# Altium schematic sheet VoltageRegulators.SchDoc
size A4
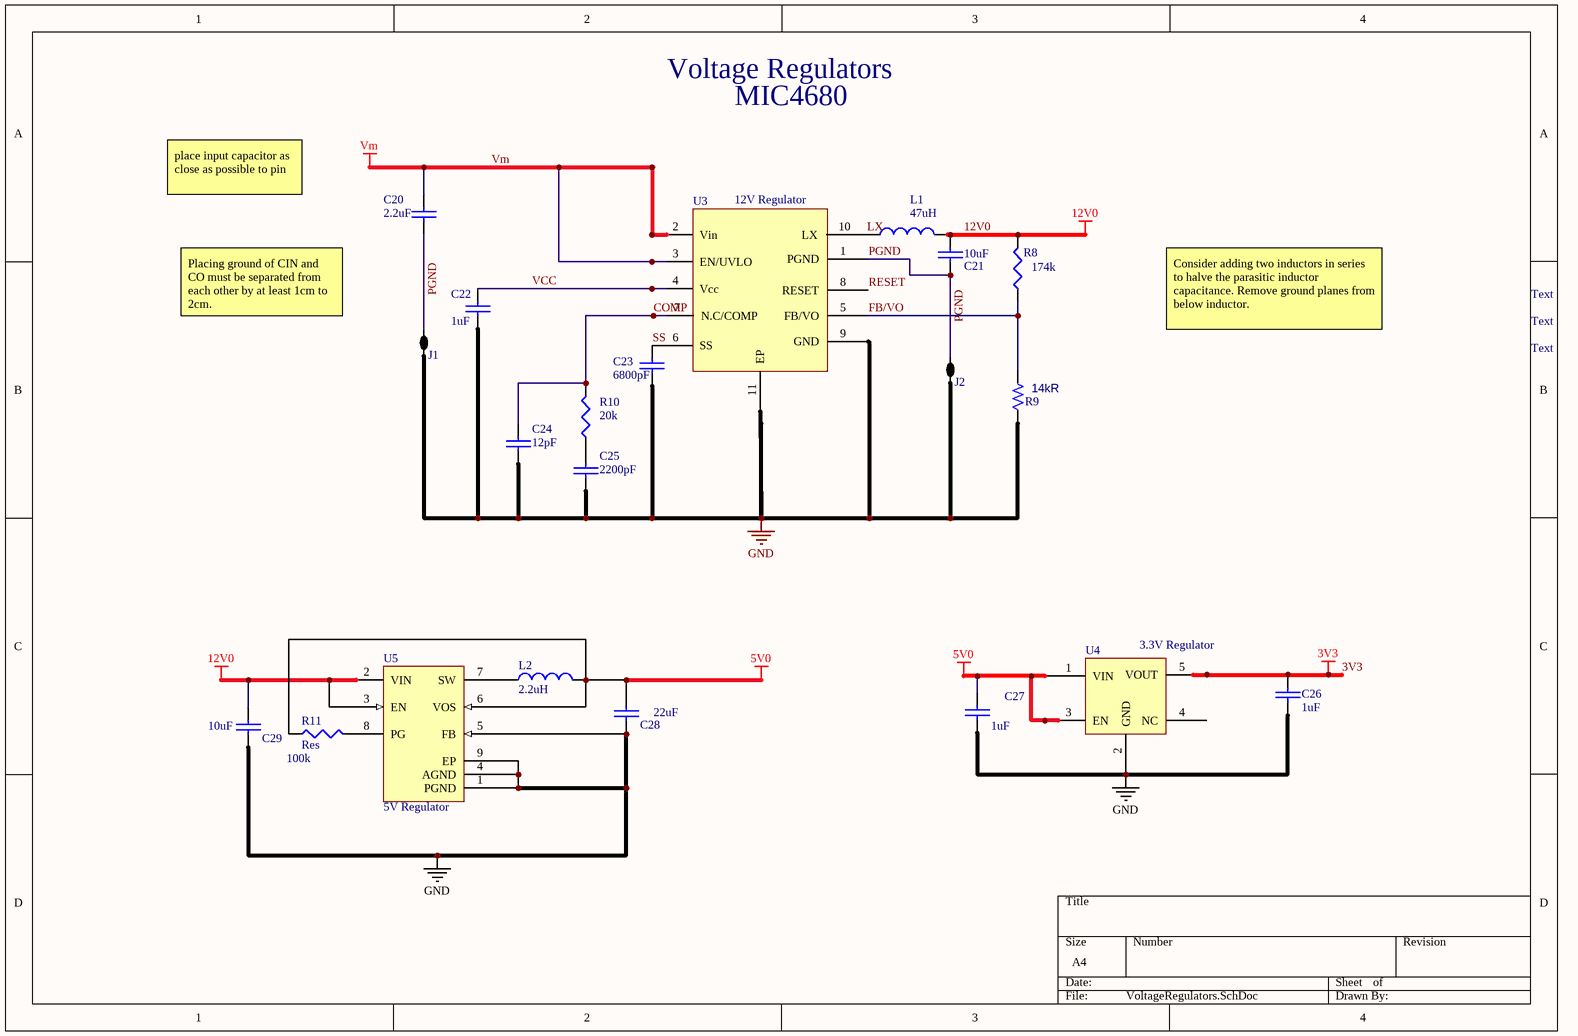
[diagram p0: VoltageRegulators.SchDoc]

## Parts
C20  value 2.2uF  [CAP0805]  (hidden comment: Capacitor)
C21  value 10uF  [CAP1210]  (hidden comment: Capacitor)
C22  value 1uF  [CAP0402]  (hidden comment: Capacitor)
C23  value 6800pF  [CAP0402]  (hidden comment: Capacitor)
C24  value 12pF  [CAP0402]  (hidden comment: Capacitor)
C25  value 2200pF  [CAP0402]  (hidden comment: Capacitor)
C26  value 1uF  [CAP0402]  (hidden comment: Capacitor)
C27  value 1uF  [CAP0402]  (hidden comment: Capacitor)
C28  value 22uF  [CAP0805]  (hidden comment: Capacitor)
C29  value 10uF  [CAP0805]  (hidden comment: Capacitor)
J1  2 way net tie junction  [2way_LP]  (value not drawn)  (net tie, no BOM)
J2  2 way net tie junction  [2way_LP]  (value not drawn)  (net tie, no BOM)
L1  value 47uH  [74404064470]  (hidden comment: Inductor)
L2  value 2.2uH  [VLS3012HBX]  (hidden comment: Inductor)
R8  value 174k  [RES0402]  (hidden comment: Res)
R9  Resistance: 14kR  [RES0402]  (hidden comment: Resistor)
R10  value 20k  [RES0402]  (hidden comment: Res)
R11  Res  value 100k  [RES0402]
U3  12V Regulator  [L10 3x2 0.5mm Pitch]
U4  3.3V Regulator  [SOT23-5]
U5  5V Regulator  [DSG8-1600X900TP]

## Nets
3V3: C26.1 U4.5(VOUT)
5V0: C27.1 C28.1 L2.2 R11.1 U4.1(VIN) U4.3(EN) U5.6(VOS)
12V0: C21.1 C29.1 L1.2 R8.2 U5.2(VIN) U5.3(EN)
GND: C22.2 C23.2 C24.2 C25.2 C26.2 C27.2 C28.2 C29.2 J1.1 J2.1 R9.1 U3.9(GND) U3.11(EP) U4.2(GND) U5.1(PGND) U5.4(AGND) U5.5(FB) U5.9(EP)
Vm: C20.1 U3.2(Vin) U3.3(EN/UVLO)
COMP: C24.1 R10.2 U3.7(N.C/COMP)
FB/VO: R8.1 R9.2 U3.5(FB/VO)
LX: L1.1 U3.10(LX)
PGND: C20.2 C21.2 J1.2 J2.2 U3.1(PGND)
RESET: U3.8(RESET)
SS: C23.1 U3.6(SS)
VCC: C22.1 U3.4(Vcc)
NetC25_1: C25.1 R10.1
NetL2_1: L2.1 U5.7(SW)
NetR11_2: R11.2 U5.8(PG)

Not connected (* = marked no-connect by the designer): U4 4(NC)

## Notes on the sheet
- Voltage Regulators
- MIC4680
- place input capacitor as close as possible to pin
- Placing ground of CIN and CO must be separated from each other by at least 1cm to 2cm.
- Text
- Consider adding two inductors in series to halve the parasitic inductor capacitance. Remove ground planes from below inductor.

## Library data of the parts
C20 = Capacitor: Manufacturer: TDK Corporation; Manufacturer Part Number: C2012X7R1V225K085AC; Tolerance: 10%; Voltage: 35V; Temperature Coefficient: X7R; Supplier: Digikey; Supplier Part Number: 445-14547-1-ND; Footprint: 0805; Component Type: Capacitor Ceramic
C21 = Capacitor: Manufacturer: KEMET; Manufacturer Part Number: C1210C106K9RAC7800; Tolerance: 10%; Voltage: 6.3V; Temperature Coefficient: X7R; Supplier: Digikey; Supplier Part Number: 399-13220-1-ND; Footprint: 1210; Component Type: Capacitor Ceramic; Price: 1.39
C22 C26 C27 = Capacitor: Manufacturer: TDK Corporation; Manufacturer Part Number: C1005X5R1V105K050BC; Tolerance: 10%; Voltage: 35V; Temperature Coefficient: X5R; Supplier: Digikey; Component Type: Capacitor Ceramic
  C22: Supplier Part Number: 445-9073-1-ND; Footprint: 0201
  C26 C27: Supplier Part Number: 1276-6795-1-ND; Footprint: 0201 (0603 Metric)
C23 = Capacitor: Manufacturer: KEMET; Manufacturer Part Number: C0402C682J5RACTU; Tolerance: 10%; Voltage: 50V; Temperature Coefficient: X7R; Supplier: Digi-Key; Supplier Part Number: 399-8975-1-ND; Footprint: 0402; Component Type: Capacitor Ceramic; Price: 0.13
C24 = Capacitor: Manufacturer: KEMET; Manufacturer Part Number: C0402C120J3GACAUTO; Tolerance: 5%; Voltage: 25; Supplier: digikey; Supplier Part Number: 399-6829-1-ND; Footprint: 0402; Component Type: Capacitor Ceramic; Price: 0.41; Temperature Coefficient: *
C25 = Capacitor: Manufacturer: Murata Electronics North America; Manufacturer Part Number: GRM155R71H222KA01D; Tolerance: 10%; Voltage: 50V; Temperature Coefficient: X7R; Supplier: Digi-Key; Supplier Part Number: 490-1305-1-ND; Footprint: 0402; Component Type: Capacitor Ceramic; Price: 0.14
C28 = Capacitor: Manufacturer: TDK Corporation; Manufacturer Part Number: C2012X5R0J226K125AB; Tolerance: 10%; Voltage: 6.3V; Temperature Coefficient: X5R; Supplier: Digikey; Supplier Part Number: 445-7679-1-ND; Footprint: 0805; Component Type: Ceramic Capacitor; Price: .99
C29 = Capacitor: Manufacturer: Murata Electronics North America; Manufacturer Part Number: GRM21BR61E106MA73L; Tolerance: 10%; Voltage: 25V; Temperature Coefficient: X5R; Supplier: Digikey; Supplier Part Number: 490-10748-1-ND; Footprint: 0805; Component Type: Ceramic Capacitor; Price: .29
J1 J2 = 2way: ComponentLink1URL: http://www.edatools.cz/addons; ComponentLink1Description: Source; FootprintNote: LP=12mil, MP=40mil, HP=120mil
L1 = Inductor: FIXED IND 47UH 1.2A 200 MOHM SMD; Manufacturer: Wurth Electronics Inc.; Component Type: Inductor; Manufacturer Part Number: 74404064470; Price: 1.63; Supplier: Digi-Key; Supplier Part Number: 732-5556-1-ND; ESR: *; Saturation Current: *
L2 = Inductor: FIXED IND 2.2UH 3.15A 106 MOHM; Manufacturer: TDK Corporation; Manufacturer Part Number: VLS3012HBX-2R2M; Component Type: Inductor; Price: 1.49; Supplier: Digikey; Supplier Part Number: 445-175069-1-ND
R8 = Resistor: Manufacturer: Yageo; Manufacturer Part Number: RC0402FR-07174KL; Power Rating: 0.063W; Tolerance: 1%; Component Type: Resistor; Price: .14; Supplier: Digikey; Supplier Part Number: YAG3008CT-ND; Footprint: 0402
R9 = Resistor: RES SMD 14K OHM 1% 1/16W 0402; Manufacturer 1: Yageo; Manufacturer Part Number 1: RC0402FR-0714KL; Power Rating: 62.5mW; Voltage Rating: 50V; Max Power Dissipation: 63mW; Temperature Coefficient: 100ppm/°C; Supplier 1: Digi-Key; Supplier Part Number 1: 311-14.0KLRCT-ND; RoHS: Yes; Category: Chip SMD Resistors; Stock 1: 350826; Pricing 1: 1=0,10000, 10=0,01600, 100=0,00640, 1000=0,00286, 2500=0,00248, 5000=0,00205 (USD); Case/Package: 0402; Case Code (Metric): 1005; Case Code (Imperial): 0402; Contact Plating: Tin,Matte; Min Operating Temperature: -55°C; Max Operating Temperature: 155°C; Package Quantity: 1; Tolerance: 1%; Packaging: Tape and Reel; Resistor Type: Thick Film; Number of Terminations: 2; Termination: SMD/SMT; Voltage Rating (DC): 50V; Working Voltage: 50V; Features: Moisture Resistant; Series: RC; Technology: THICK FILM; Construction: Rectangular; Length: 1mm; Width: 0.02inch; Height: 0.016inch; Depth: 0.5mm; Military Standard: Not; Lead Free: Lead Free; RoHS Compliant: Yes; ComponentLink1URL: https://datasheet.ciiva.com/2453/pyu-r-int-thick-7-2453600.pdf?src-supplier=Digi-Key; ComponentLink1Description: https://datasheet.ciiva.com/2453/pyu-r-int-thick-7-2453600.pdf?src-supplier=Digi-Key; ComponentLink2URL: https://datasheet.ciiva.com/16869/pyu-rc0402-51-rohs-l-6-16869077.pdf?src-supplier=Avnet+Europe; ComponentLink2Description: https://datasheet.ciiva.com/16869/pyu-rc0402-51-rohs-l-6-16869077.pdf?src-supplier=Avnet+Europe; ComponentLink3URL: https://datasheet.ciiva.com/28404/pyu-rc0402-51-rohs-l-6-28404357.pdf?src-supplier=Avnet+Europe; ComponentLink3Description: https://datasheet.ciiva.com/28404/pyu-rc0402-51-rohs-l-6-28404357.pdf?src-supplier=Avnet+Europe; ComponentLink4URL: https://datasheet.ciiva.com/8890/pyu-rc0402-51-rohs-l-6-8890872.pdf?src-supplier=Avnet; ComponentLink4Description: https://datasheet.ciiva.com/8890/pyu-rc0402-51-rohs-l-6-8890872.pdf?src-supplier=Avnet; ComponentLink5URL: https://datasheet.ciiva.com/2453/pyu-r-int-thick-7-2453598.pdf?src-supplier=Digi-Key; ComponentLink5Description: https://datasheet.ciiva.com/2453/pyu-r-int-thick-7-2453598.pdf?src-supplier=Digi-Key; ComponentLink6URL: https://datasheet.ciiva.com/2453/pyu-r-int-thick-7-2453599.pdf?src-supplier=Digi-Key; ComponentLink6Description: https://datasheet.ciiva.com/2453/pyu-r-int-thick-7-2453599.pdf?src-supplier=Digi-Key
R10 = Resistor: Manufacturer: Yageo; Manufacturer Part Number: RT0402DRD0720KL; Power Rating: 0.063; Tolerance: ±0.5%; Component Type: Resistor; Price: .14; Supplier: Digikey; Supplier Part Number: 311-2157-1-ND; Footprint: 0402
R11 = Resistor: Manufacturer: Yageo; Manufacturer Part Number: RC0402FR-07100KL; Power Rating: 0.063; Tolerance: 1%; Component Type: Resistor; Price: .15; Supplier: Digikey; Supplier Part Number: 311-100KLRCT-ND; Footprint: 0402
U3 = MAX17502G: 60V, 1A, Ultra-Small, High-Efficiency,  Synchronous Step-Down DC-DC Converter; Manufacturer: Maxim Integrated; Manufacturer Part Number: MAX17502GATB+T; Supplier 1: Digi-Key; Supplier Part Number 1: MAX17502GATB+TCT-ND; Component Type: Synchronous Step-Down DC-DC Converter; Supplier: Digi-Key; Supplier Part Number: MAX17502GATB+TCT-ND
U4 = MIC5501_SOT23-5: MIC5504_SOT23-5; Manufacturer: Microchip Technology; Manufacturer Part Number: MIC5504-3.3YM5-TR; Footprint: SOT-23-5; Price: 0.16; Supplier: Digi-Key; Supplier Part Number: 576-4764-1-ND; Component Type: IC REG LINEAR 3.3V 300MA SOT23-5
U5 = TPS62163DSGR: Buck Step Down Regulator with 3 to 17 V Input and 5 V Output, -40 to 85 degC, 8-Pin WSON (DSG), Green (RoHS & no Sb/Br); Manufacturer: Texas Instruments; Duty Cycle(Max)(%): 100; Iout(Max)(A): 1; Iq(Typ)(mA): 0.017; Preset Vout(V): 5; Rating: Catalog; SubFamily: Step-Down Regulator; Switch Current Limit(Typ)(A): 1.8; Synchronous Rectification: TRUE; Vin(Max)(V): 17; Vin(Min)(V): 3; DatasheetVersion: SLVSAM2A; PackageVersion: revB, Oct-2010; PackageReference: DSG8-1600X900TP; PackageDescription: 8-Pin Plastic Small Outline No-Lead, 2 x 2 x 0.8 mm Body, 0.5 mm Pitch, Exposed Pad; Supplier 1: Digi-Key; Supplier Part Number 1: 296-29898-2-ND; Supplier 2: Digi-Key; Supplier Part Number 2: 296-29898-1-ND; Supplier 3: Digi-Key; Supplier Part Number 3: 296-29898-6-ND; Supplier 4: Newark; Supplier Part Number 4: 74T5559; Supplier 5: Mouser; Supplier Part Number 5: 595-TPS62163DSGR; Eco-Plan: Green (RoHS & no Sb/Br); Regulated Outputs(#): 1; Topology: Buck; Vout(Max)(V): 5; Vout(Min)(V): 5; Mounting Technology: Surface Mount; Code_JEDEC: MO-229; PartNumber: TPS62163DSGR; ComponentLink1Description: Datasheet; ComponentLink1URL: http://www.ti.com/general/docs/lit/getliterature.tsp?genericPartNumber=TPS62163&fileType=pdf; ComponentLink2Description: Package Specification; ComponentLink2URL: http://www.ti.com/litv/pdf/mpds308a; ComponentLink3Description: URL Link1; ComponentLink3URL: Samples URL:http://www.ti.com/product/tps62163#samples; Component Type: Buck Step Down Regulator; Manufacturer Part Number: TPS62163DSGR; Supplier: Digi-Key; Supplier Part Number: 296-29898-1-ND